# Altium project S11830_3344MT_2SiPM.PrjPCB
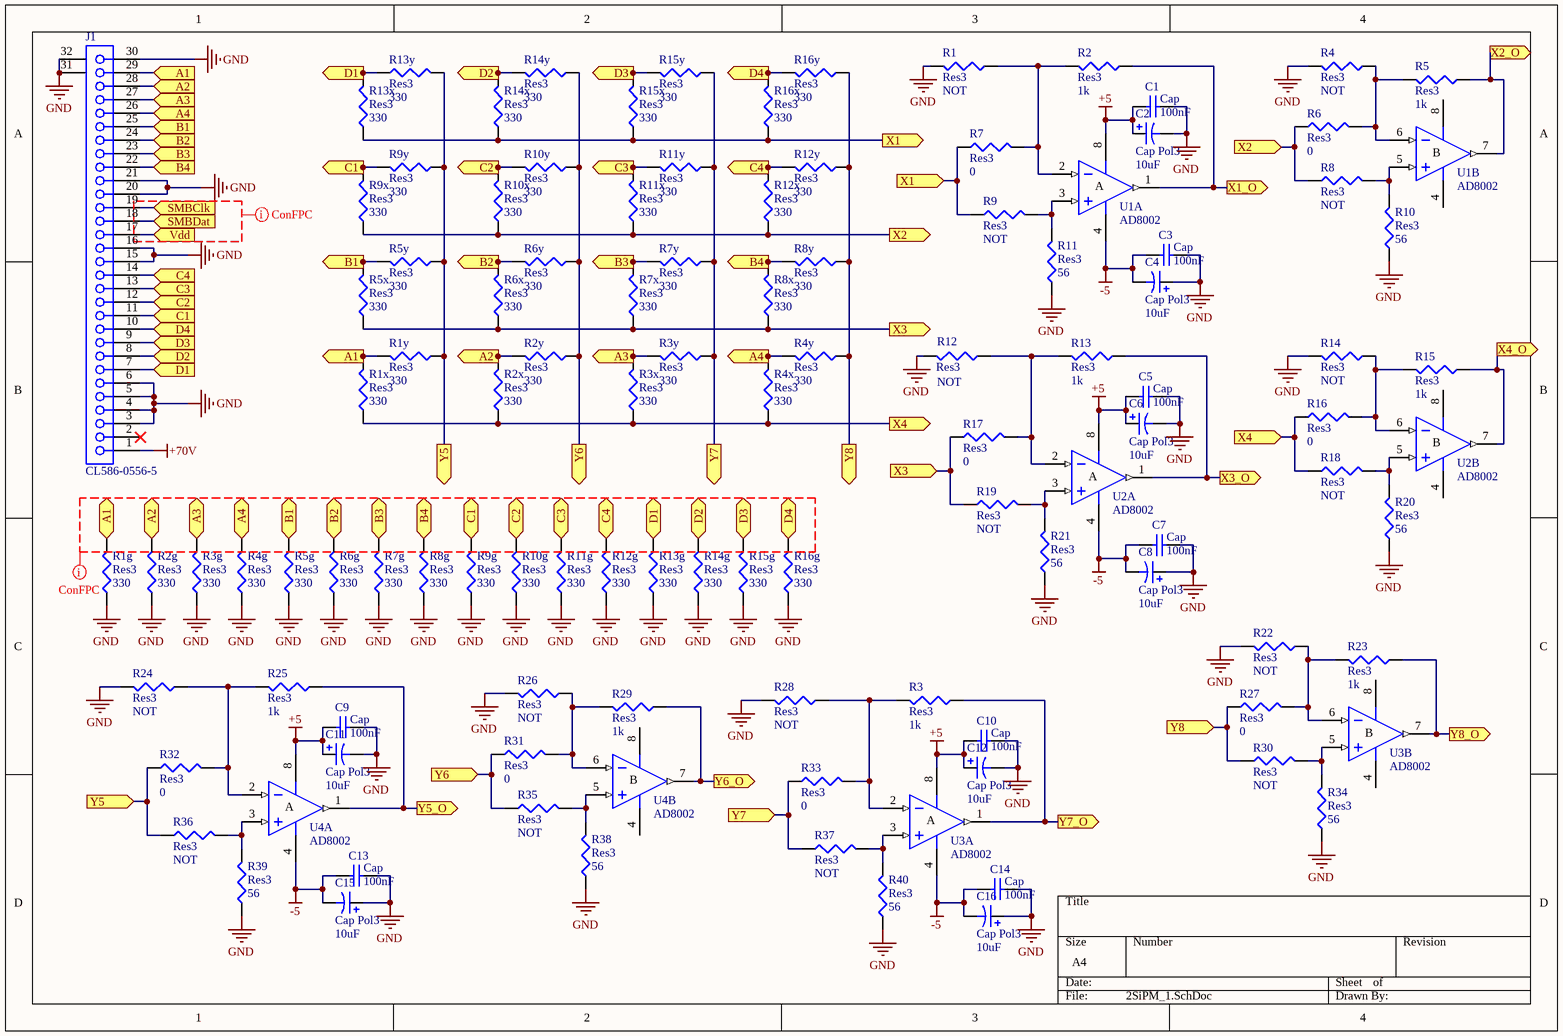
[diagram p0: 2SiPM_1.SchDoc]
4 sheets, 330 parts. Net scope: flat (ports and power ports of the same name join across sheets).
Board file: 2SiPM_PCB.PcbDoc
Sheets:
  2SiPM_1.SchDoc
  2SiPM_2.SchDoc
  2SiPM_3.SchDoc
  2SiPM_4.SchDoc

## Sheet 2SiPM_1.SchDoc
size A4

### Parts
C1  Cap  value 100nF  [6-0805_N]
C2  Cap Pol3  value 10uF  [6-0805_N]
C3  Cap  value 100nF  [6-0805_N]
C4  Cap Pol3  value 10uF  [6-0805_N]
C5  Cap  value 100nF  [6-0805_N]
C6  Cap Pol3  value 10uF  [6-0805_N]
C7  Cap  value 100nF  [6-0805_N]
C8  Cap Pol3  value 10uF  [6-0805_N]
C9  Cap  value 100nF  [6-0805_N]
C10  Cap  value 100nF  [6-0805_N]
C11  Cap Pol3  value 10uF  [6-0805_N]
C12  Cap Pol3  value 10uF  [6-0805_N]
C13  Cap  value 100nF  [6-0805_N]
C14  Cap  value 100nF  [6-0805_N]
C15  Cap Pol3  value 10uF  [6-0805_N]
C16  Cap Pol3  value 10uF  [6-0805_N]
J1  CL586-0556-5  [FH12A-30S-0.5SH]
R1  Res3  value NOT  [J1-0603]
R1g  Res3  value 330  [0402]
R1x  Res3  value 330  [0402]
R1y  Res3  value 330  [0402]
R2  Res3  value 1k  [J1-0603]
R2g  Res3  value 330  [0402]
R2x  Res3  value 330  [0402]
R2y  Res3  value 330  [0402]
R3  Res3  value 1k  [J1-0603]
R3g  Res3  value 330  [0402]
R3x  Res3  value 330  [0402]
R3y  Res3  value 330  [0402]
R4  Res3  value NOT  [J1-0603]
R4g  Res3  value 330  [0402]
R4x  Res3  value 330  [0402]
R4y  Res3  value 330  [0402]
R5  Res3  value 1k  [J1-0603]
R5g  Res3  value 330  [0402]
R5x  Res3  value 330  [0402]
R5y  Res3  value 330  [0402]
R6  Res3  value 0  [J1-0603]
R6g  Res3  value 330  [0402]
R6x  Res3  value 330  [0402]
R6y  Res3  value 330  [0402]
R7  Res3  value 0  [J1-0603]
R7g  Res3  value 330  [0402]
R7x  Res3  value 330  [0402]
R7y  Res3  value 330  [0402]
R8  Res3  value NOT  [J1-0603]
R8g  Res3  value 330  [0402]
R8x  Res3  value 330  [0402]
R8y  Res3  value 330  [0402]
R9  Res3  value NOT  [J1-0603]
R9g  Res3  value 330  [0402]
R9x  Res3  value 330  [0402]
R9y  Res3  value 330  [0402]
R10  Res3  value 56  [J1-0603]
R10g  Res3  value 330  [0402]
R10x  Res3  value 330  [0402]
R10y  Res3  value 330  [0402]
R11  Res3  value 56  [J1-0603]
R11g  Res3  value 330  [0402]
R11x  Res3  value 330  [0402]
R11y  Res3  value 330  [0402]
R12  Res3  value NOT  [J1-0603]
R12g  Res3  value 330  [0402]
R12x  Res3  value 330  [0402]
R12y  Res3  value 330  [0402]
R13  Res3  value 1k  [J1-0603]
R13g  Res3  value 330  [0402]
R13x  Res3  value 330  [0402]
R13y  Res3  value 330  [0402]
R14  Res3  value NOT  [J1-0603]
R14g  Res3  value 330  [0402]
R14x  Res3  value 330  [0402]
R14y  Res3  value 330  [0402]
R15  Res3  value 1k  [J1-0603]
R15g  Res3  value 330  [0402]
R15x  Res3  value 330  [0402]
R15y  Res3  value 330  [0402]
R16  Res3  value 0  [J1-0603]
R16g  Res3  value 330  [0402]
R16x  Res3  value 330  [0402]
R16y  Res3  value 330  [0402]
R17  Res3  value 0  [J1-0603]
R18  Res3  value NOT  [J1-0603]
R19  Res3  value NOT  [J1-0603]
R20  Res3  value 56  [J1-0603]
R21  Res3  value 56  [J1-0603]
R22  Res3  value NOT  [J1-0603]
R23  Res3  value 1k  [J1-0603]
R24  Res3  value NOT  [J1-0603]
R25  Res3  value 1k  [J1-0603]
R26  Res3  value NOT  [J1-0603]
R27  Res3  value 0  [J1-0603]
R28  Res3  value NOT  [J1-0603]
R29  Res3  value 1k  [J1-0603]
R30  Res3  value NOT  [J1-0603]
R31  Res3  value 0  [J1-0603]
R32  Res3  value 0  [J1-0603]
R33  Res3  value 0  [J1-0603]
R34  Res3  value 56  [J1-0603]
R35  Res3  value NOT  [J1-0603]
R36  Res3  value NOT  [J1-0603]
R37  Res3  value NOT  [J1-0603]
R38  Res3  value 56  [J1-0603]
R39  Res3  value 56  [J1-0603]
R40  Res3  value 56  [J1-0603]
U1  AD8002  [SO-8_M]  (parts A,B of 2)
U2  AD8002  [SO-8_M]  (parts A,B of 2)
U3  AD8002  [SO-8_M]  (parts A,B of 2)
U4  AD8002  [SO-8_M]  (parts A,B of 2)

### Ports
A1 (in), A1 (out), A2 (in), A2 (out), A3 (in), A3 (out), A4 (in), A4 (out), B1 (in), B1 (out), B2 (in), B2 (out), B3 (in), B3 (out), B4 (in), B4 (out), C1 (in), C1 (out), C2 (in), C2 (out), C3 (in), C3 (out), C4 (in), C4 (out), D1 (in), D1 (out), D2 (in), D2 (out), D3 (in), D3 (out), D4 (in), D4 (out), SMBClk (in), SMBDat (in), Vdd (in), X1 (in), X1 (out), X1_O (out), X2 (in), X2 (out), X2_O (out), X3 (in), X3 (out), X3_O (out), X4 (in), X4 (out), X4_O (out), Y5 (in), Y5 (out), Y5_O (out), Y6 (in), Y6 (out), Y6_O (out), Y7 (in), Y7 (out), Y7_O (out), Y8 (in), Y8 (out), Y8_O (out)

### Nets
+5: C1.2 C2.1 C5.2 C6.1 C9.2 C10.2 C11.1 C12.1 U1.8(V+) U2.8(V+) U3.8(V+) U4.8(V+)
+70V: J1.1
-5: C3.2 C4.2 C7.2 C8.2 C13.2 C14.2 C15.2 C16.2 U1.4(V-) U2.4(V-) U3.4(V-) U4.4(V-)
GND: C1.1 C2.2 C3.1 C4.1 C5.1 C6.2 C7.1 C8.1 C9.1 C10.1 C11.2 C12.2 C13.1 C14.1 C15.1 C16.1 J1.3 J1.4 J1.5 J1.6 J1.15 J1.16 J1.20 J1.21 J1.30 J1.31(MH1) J1.32(MH2) R1.2 R1g.1 R2g.1 R3g.1 R4.2 R4g.1 R5g.1 R6g.1 R7g.1 R8g.1 R9g.1 R10.1 R10g.1 R11.1 R11g.1 R12.2 R12g.1 R13g.1 R14.2 R14g.1 R15g.1 R16g.1 R20.1 R21.1 R22.2 R24.2 R26.2 R28.2 R34.1 R38.1 R39.1 R40.1
NetC1x_1: R2.1 U1.1(OUT) ; port X1_O
NetC2x_1: R5.1 U1.7(OUT) ; port X2_O
NetC3x_1: R13.1 U2.1(OUT) ; port X3_O
NetC4x_1: R15.1 U2.7(OUT) ; port X4_O
NetC5y_1: R25.1 U4.1(OUT) ; port Y5_O
NetC6y_1: R29.1 U4.7(OUT) ; port Y6_O
NetC7y_1: R3.1 U3.1(OUT) ; port Y7_O
NetC8y_1: R23.1 U3.7(OUT) ; port Y8_O
NetJ1_7: J1.7 R13g.2 R13x.2 R13y.1 ; port D1
NetJ1_8: J1.8 R14g.2 R14x.2 R14y.2 ; port D2
NetJ1_9: J1.9 R15g.2 R15x.2 R15y.2 ; port D3
NetJ1_10: J1.10 R16g.2 R16x.2 R16y.2 ; port D4
NetJ1_11: J1.11 R9g.2 R9x.2 R9y.2 ; port C1
NetJ1_12: J1.12 R10g.2 R10x.2 R10y.2 ; port C2
NetJ1_13: J1.13 R11g.2 R11x.2 R11y.2 ; port C3
NetJ1_14: J1.14 R12g.2 R12x.2 R12y.2 ; port C4
NetJ1_17: J1.17 ; port Vdd
NetJ1_18: J1.18 ; port SMBDat
NetJ1_19: J1.19 ; port SMBClk
NetJ1_22: J1.22 R8g.2 R8x.2 R8y.2 ; port B4
NetJ1_23: J1.23 R7g.2 R7x.2 R7y.2 ; port B3
NetJ1_24: J1.24 R6g.2 R6x.2 R6y.2 ; port B2
NetJ1_25: J1.25 R5g.2 R5x.2 R5y.2 ; port B1
NetJ1_26: J1.26 R4g.2 R4x.2 R4y.2 ; port A4
NetJ1_27: J1.27 R3g.2 R3x.2 R3y.2 ; port A3
NetJ1_28: J1.28 R2g.2 R2x.2 R2y.2 ; port A2
NetJ1_29: J1.29 R1g.2 R1x.2 R1y.2 ; port A1
NetR1_1: R1.1 R2.2 R7.2 U1.2(IN-)
NetR1x_1: R1x.1 R2x.1 R3x.1 R4x.1 R16.1 R18.1 ; port X4
NetR1x_1_1: R7.1 R9.1 R13x.1 R14x.1 R15x.1 R16x.1 ; port X1
NetR1y_1: R1y.1 R5y.1 R9y.1 R13y.2 R32.1 R36.1 ; port Y5
NetR2y_1: R2y.1 R6y.1 R10y.1 R14y.1 R31.1 R35.1 ; port Y6
NetR3_2: R3.2 R28.1 R33.2 U3.2(IN-)
NetR3y_1: R3y.1 R7y.1 R11y.1 R15y.1 R33.1 R37.1 ; port Y7
NetR4_1: R4.1 R5.2 R6.2 U1.6(IN-)
NetR4y_1: R4y.1 R8y.1 R12y.1 R16y.1 R27.1 R30.1 ; port Y8
NetR5x_1: R5x.1 R6x.1 R7x.1 R8x.1 R17.1 R19.1 ; port X3
NetR5x_1_1: R6.1 R8.1 R9x.1 R10x.1 R11x.1 R12x.1 ; port X2
NetR8_2: R8.2 R10.2 U1.5(IN+)
NetR9_2: R9.2 R11.2 U1.3(IN+)
NetR12_1: R12.1 R13.2 R17.2 U2.2(IN-)
NetR14_1: R14.1 R15.2 R16.2 U2.6(IN-)
NetR18_2: R18.2 R20.2 U2.5(IN+)
NetR19_2: R19.2 R21.2 U2.3(IN+)
NetR22_1: R22.1 R23.2 R27.2 U3.6(IN-)
NetR24_1: R24.1 R25.2 R32.2 U4.2(IN-)
NetR26_1: R26.1 R29.2 R31.2 U4.6(IN-)
NetR30_2: R30.2 R34.2 U3.5(IN+)
NetR35_2: R35.2 R38.2 U4.5(IN+)
NetR36_2: R36.2 R39.2 U4.3(IN+)
NetR37_2: R37.2 R40.2 U3.3(IN+)

Not connected (* = marked no-connect by the designer): J1 2*

### Layout directives
net class Undefined: (no net found under the mark)

### Notes on the sheet
- (in symbol AD8002AR, part A) A
- (in symbol AD8002AR, part B) B

### Library data of the parts
C1 C3 C5 C7 C9 C10 C13 C14 = Cap: Capacitor; Published: 8-Jun-2000; LatestRevisionDate: 17-Jul-2002; LatestRevisionNote: Re-released for DXP Platform.; PackageReference: RAD-0.3; Publisher: Altium Limited; PackageDescription: Radial Cap, Thru-Hole; 2 Leads; 0.3 in Pin Spacing
C2 C4 C6 C8 C11 C12 C15 C16 = Cap Pol3: Polarized Capacitor (Surface Mount); Published: 8-Jun-2000; LatestRevisionDate: 29-May-2009; LatestRevisionNote: IPC-7351 Footprint Added.; PackageReference: C0805; Publisher: Altium Limited; PackageDescription: Chip Capacitor
J1 = CL586-0556-5: FH12 Series, "Flip-Lock" SMT/ZIF FFC/FPC Connector - 0.5mm Spaced Top Contact; Positions: 30; ContactMaterial: Phosphor Bronze; Current: 0.4A; PCB_Layout: Complies with manufacturer's recommendation.; Note: Pad dimensions follow nominal values, Suitable for Wave Soldering, Adjust for Re-flow.; Published: 17-Jul-2002; DatasheetVersion: 13-Nov-2000; PackageVersion: 13-Nov-2000; PackageReference: FH12A-30S-0.5SH; Publisher: Altium Limited; ComponentLink1Description: Manufacturer Link; ComponentLink1URL: http://www.hiroseusa.com/; ComponentLink2Description: Datasheet; ComponentLink2URL: http://www.hirose.co.jp/cataloge_hp/e58605370.pdf
R1 R1g R1x R1y R2 R2g R2x R2y R3 R3g R3x R3y R4 R4g R4x R4y R5 R5g R5x R5y R6 R6g R6x R6y R7 R7g R7x R7y R8 R8g R8x R8y R9 R9g R9x R9y R10 R10g R10x R10y R11 R11g R11x R11y R12 R12g R12x R12y R13 R13g R13x R13y R14 R14g R14x R14y R15 R15g R15x R15y R16 R16g R16x R16y R17-R40 = Res3: Resistor; Published: 8-Jun-2000; LatestRevisionDate: 29-May-2009; LatestRevisionNote: IPC-7351 Footprint Added.; PackageReference: J1-0603; Publisher: Altium Limited; PackageDescription: Chip Resistor
U1-U4 = AD8002AR: Dual 600MHz, 50mW Current Feedback Amplifier; Published: 8-Jun-2000; LatestRevisionDate: 13-Apr-2006; LatestRevisionNote: IPC-7351 Footprint Added.; DatasheetVersion: REV. C 1999; PackageVersion: revA; PackageReference: SO-8; Publisher: Altium Limited; PackageDescription: 8-Pin Small Outline Integrated Circuit 1.27 mm Pitch; Code_JEDEC: MS-012-AA; Code_IPC: SOIC127P600-8; ComponentLink1Description: Manufacturer Link; ComponentLink1URL: http://www.analog.com/en/prod/0,,759_786_AD8002%2C00.html; ComponentLink2Description: Datasheet; ComponentLink2URL: http://www.analog.com/UploadedFiles/Data_Sheets/147523773AD8002_d.pdf

## Sheet 2SiPM_2.SchDoc
size A4
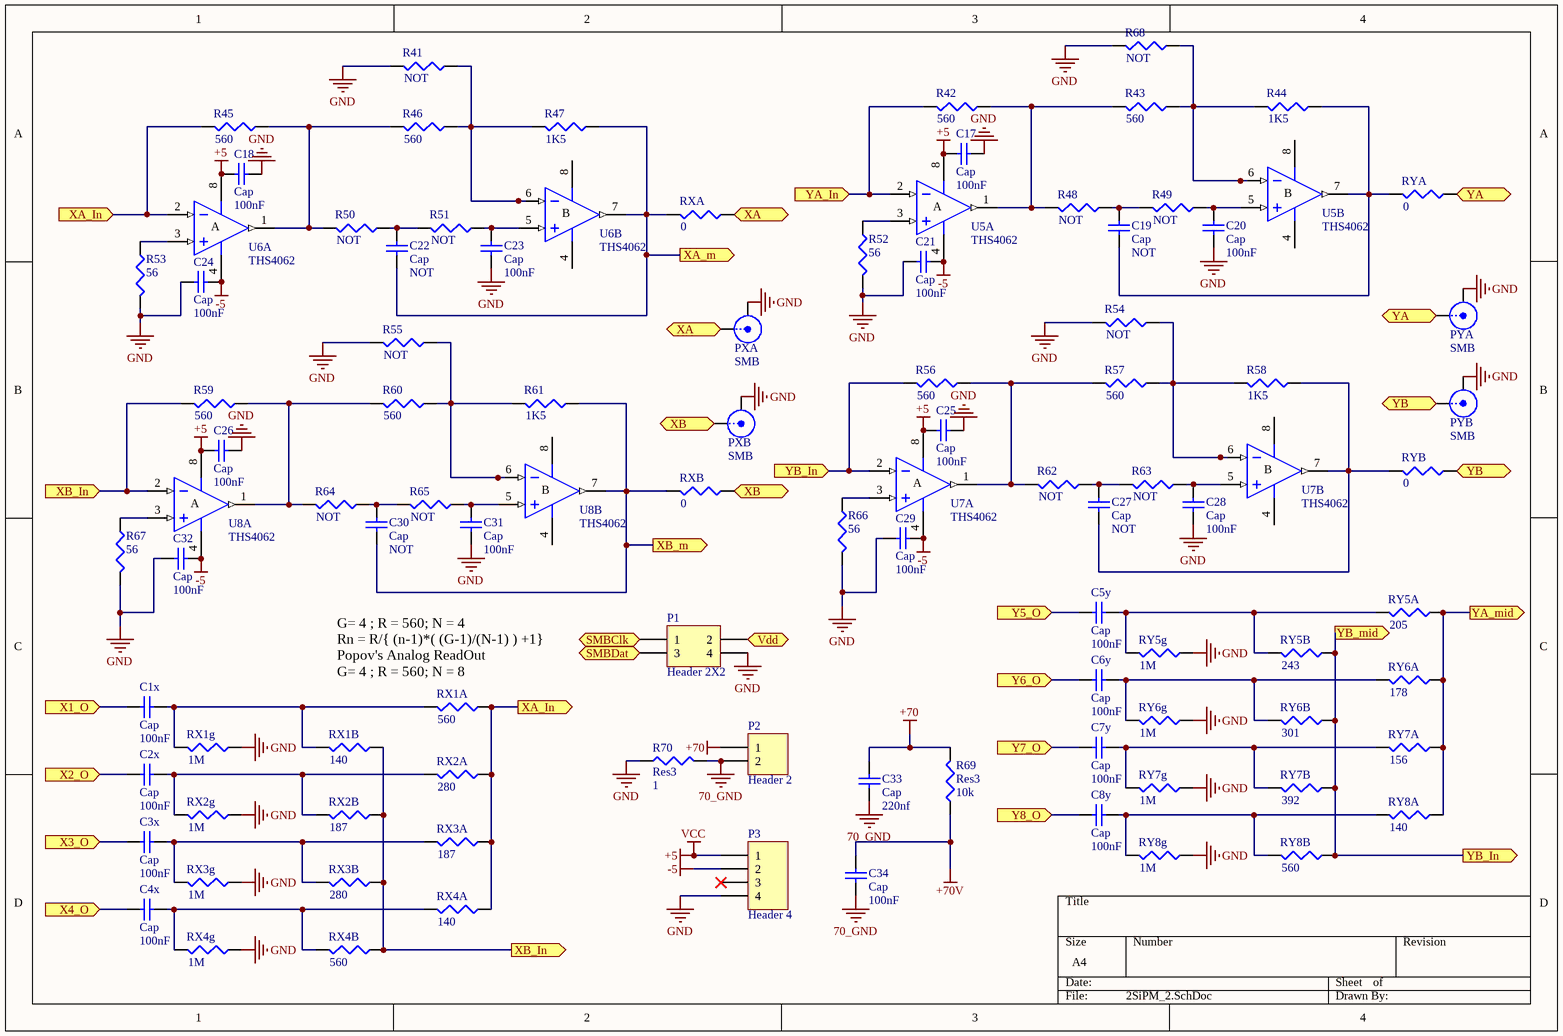
[diagram p1: 2SiPM_2.SchDoc]

### Parts
C1x  Cap  value 100nF  [1608[0603]]
C2x  Cap  value 100nF  [1608[0603]]
C3x  Cap  value 100nF  [1608[0603]]
C4x  Cap  value 100nF  [1608[0603]]
C5y  Cap  value 100nF  [1608[0603]]
C6y  Cap  value 100nF  [1608[0603]]
C7y  Cap  value 100nF  [1608[0603]]
C8y  Cap  value 100nF  [1608[0603]]
C17  Cap  value 100nF  [1608[0603]]
C18  Cap  value 100nF  [1608[0603]]
C19  Cap  value NOT  [1608[0603]]
C20  Cap  value 100nF  [1608[0603]]
C21  Cap  value 100nF  [1608[0603]]
C22  Cap  value NOT  [1608[0603]]
C23  Cap  value 100nF  [1608[0603]]
C24  Cap  value 100nF  [1608[0603]]
C25  Cap  value 100nF  [1608[0603]]
C26  Cap  value 100nF  [1608[0603]]
C27  Cap  value NOT  [1608[0603]]
C28  Cap  value 100nF  [1608[0603]]
C29  Cap  value 100nF  [1608[0603]]
C30  Cap  value NOT  [1608[0603]]
C31  Cap  value 100nF  [1608[0603]]
C32  Cap  value 100nF  [1608[0603]]
C33  Cap  value 220nf  [6-0805_N]
C34  Cap  value 100nF  [6-0805_N]
P1  Header 2X2  [HDR2X2]
P2  Header 2  [HDR1X2]
P3  Header 4  [HDR1X4]
PXA  SMB  [SMB_V-RJ45]
PXB  SMB  [SMB_V-RJ45]
PYA  SMB  [SMB_V-RJ45]
PYB  SMB  [SMB_V-RJ45]
R41  value NOT  [J1-0603]  (hidden comment: Res3)
R42  value 560  [J1-0603]  (hidden comment: Res3)
R43  value 560  [J1-0603]  (hidden comment: Res3)
R44  value 1K5  [J1-0603]  (hidden comment: Res3)
R45  value 560  [J1-0603]  (hidden comment: Res3)
R46  value 560  [J1-0603]  (hidden comment: Res3)
R47  value 1K5  [J1-0603]  (hidden comment: Res3)
R48  value NOT  [J1-0603]  (hidden comment: Res3)
R49  value NOT  [J1-0603]  (hidden comment: Res3)
R50  value NOT  [J1-0603]  (hidden comment: Res3)
R51  value NOT  [J1-0603]  (hidden comment: Res3)
R52  value 56  [J1-0603]  (hidden comment: Res3)
R53  value 56  [J1-0603]  (hidden comment: Res3)
R54  value NOT  [J1-0603]  (hidden comment: Res3)
R55  value NOT  [J1-0603]  (hidden comment: Res3)
R56  value 560  [J1-0603]  (hidden comment: Res3)
R57  value 560  [J1-0603]  (hidden comment: Res3)
R58  value 1K5  [J1-0603]  (hidden comment: Res3)
R59  value 560  [J1-0603]  (hidden comment: Res3)
R60  value 560  [J1-0603]  (hidden comment: Res3)
R61  value 1K5  [J1-0603]  (hidden comment: Res3)
R62  value NOT  [J1-0603]  (hidden comment: Res3)
R63  value NOT  [J1-0603]  (hidden comment: Res3)
R64  value NOT  [J1-0603]  (hidden comment: Res3)
R65  value NOT  [J1-0603]  (hidden comment: Res3)
R66  value 56  [J1-0603]  (hidden comment: Res3)
R67  value 56  [J1-0603]  (hidden comment: Res3)
R68  value NOT  [J1-0603]  (hidden comment: Res3)
R69  Res3  value 10k  [6-0805_N]
R70  Res3  value 1  [6-0805_N]
RX1A  value 560  [J1-0603]  (hidden comment: Res3)
RX1B  value 140  [J1-0603]  (hidden comment: Res3)
RX1g  value 1M  [J1-0603]  (hidden comment: Res3)
RX2A  value 280  [J1-0603]  (hidden comment: Res3)
RX2B  value 187  [J1-0603]  (hidden comment: Res3)
RX2g  value 1M  [J1-0603]  (hidden comment: Res3)
RX3A  value 187  [J1-0603]  (hidden comment: Res3)
RX3B  value 280  [J1-0603]  (hidden comment: Res3)
RX3g  value 1M  [J1-0603]  (hidden comment: Res3)
RX4A  value 140  [J1-0603]  (hidden comment: Res3)
RX4B  value 560  [J1-0603]  (hidden comment: Res3)
RX4g  value 1M  [J1-0603]  (hidden comment: Res3)
RXA  value 0  [J1-0603]  (hidden comment: Res3)
RXB  value 0  [J1-0603]  (hidden comment: Res3)
RY5A  value 205  [J1-0603]  (hidden comment: Res3)
RY5B  value 243  [J1-0603]  (hidden comment: Res3)
RY5g  value 1M  [J1-0603]  (hidden comment: Res3)
RY6A  value 178  [J1-0603]  (hidden comment: Res3)
RY6B  value 301  [J1-0603]  (hidden comment: Res3)
RY6g  value 1M  [J1-0603]  (hidden comment: Res3)
RY7A  value 156  [J1-0603]  (hidden comment: Res3)
RY7B  value 392  [J1-0603]  (hidden comment: Res3)
RY7g  value 1M  [J1-0603]  (hidden comment: Res3)
RY8A  value 140  [J1-0603]  (hidden comment: Res3)
RY8B  value 560  [J1-0603]  (hidden comment: Res3)
RY8g  value 1M  [J1-0603]  (hidden comment: Res3)
RYA  value 0  [J1-0603]  (hidden comment: Res3)
RYB  value 0  [J1-0603]  (hidden comment: Res3)
U5  THS4062  [SO8_M]  (parts A,B of 2)
U6  THS4062  [SO8_M]  (parts A,B of 2)
U7  THS4062  [SO8_M]  (parts A,B of 2)
U8  THS4062  [SO8_M]  (parts A,B of 2)

### Ports
SMBClk (out), SMBDat (out), Vdd (out), X1_O (in), X2_O (in), X3_O (in), X4_O (in), XA (out), XA_In (in), XA_In (out), XA_m (out), XB (out), XB_In (in), XB_In (out), XB_m (out), Y5_O (in), Y6_O (in), Y7_O (in), Y8_O (in), YA (out), YA_In (in), YA_mid (out), YB (out), YB_In (in), YB_In (out), YB_mid (out)

### Nets
70_GND: C33.1 C34.1 P2.2 R70.2
+5: C17.1 C18.1 C25.1 C26.1 P3.1 U5.8(V+) U6.8(V+) U7.8(V+) U8.8(V+)  [also labelled VCC]
+70: C33.2 P2.1 R69.2
+70V: C34.2 R69.1
-5: C21.2 C24.2 C29.2 C32.2 P3.2 U5.4(V-) U6.4(V-) U7.4(V-) U8.4(V-)
GND: C17.2 C18.2 C20.2 C21.1 C23.2 C24.1 C25.2 C26.2 C28.2 C29.1 C31.2 C32.1 P1.4 P3.4 PXA.2(Y) PXB.2(Y) PYA.2(Y) PYB.2(Y) R41.2 R52.2 R53.2 R54.2 R55.2 R66.2 R67.2 R68.2 R70.1 RX1g.1 RX2g.1 RX3g.1 RX4g.1 RY5g.1 RY6g.1 RY7g.1 RY8g.1
NetC1x_1: C1x.1 ; port X1_O
NetC1x_2: C1x.2 RX1A.2 RX1B.2 RX1g.2
NetC2x_1: C2x.1 ; port X2_O
NetC2x_2: C2x.2 RX2A.2 RX2B.2 RX2g.2
NetC3x_1: C3x.1 ; port X3_O
NetC3x_2: C3x.2 RX3A.2 RX3B.2 RX3g.2
NetC4x_1: C4x.1 ; port X4_O
NetC4x_2: C4x.2 RX4A.2 RX4B.2 RX4g.2
NetC5y_1: C5y.1 ; port Y5_O
NetC5y_2: C5y.2 RY5A.2 RY5B.2 RY5g.2
NetC6y_1: C6y.1 ; port Y6_O
NetC6y_2: C6y.2 RY6A.2 RY6B.2 RY6g.2
NetC7y_1: C7y.1 ; port Y7_O
NetC7y_2: C7y.2 RY7A.2 RY7B.2 RY7g.2
NetC8y_1: C8y.1 ; port Y8_O
NetC8y_2: C8y.2 RY8A.2 RY8B.2 RY8g.2
NetC19_1: C19.1 R48.1 R49.2
NetC19_2: C19.2 R44.1 RYA.2 U5.7(OUT)
NetC20_1: C20.1 R49.1 U5.5(IN+)
NetC22_1: C22.1 R50.1 R51.2
NetC22_2: C22.2 R47.1 RXA.2 U6.7(OUT) ; port XA_m
NetC23_1: C23.1 R51.1 U6.5(IN+)
NetC27_1: C27.1 R62.1 R63.2
NetC27_2: C27.2 R58.1 RYB.2 U7.7(OUT)
NetC28_1: C28.1 R63.1 U7.5(IN+)
NetC30_1: C30.1 R64.1 R65.2
NetC30_2: C30.2 R61.1 RXB.2 U8.7(OUT) ; port XB_m
NetC31_1: C31.1 R65.1 U8.5(IN+)
NetJ1_17: P1.2 ; port Vdd
NetJ1_18: P1.3 ; port SMBDat
NetJ1_19: P1.1 ; port SMBClk
NetPXA_1: PXA.1(X) RXA.1 ; port XA
NetPXB_1: PXB.1(X) RXB.1 ; port XB
NetPYA_1: PYA.1(X) RYA.1 ; port YA
NetPYB_1: PYB.1(X) RYB.1 ; port YB
NetR41_1: R41.1 R46.1 R47.2 U6.6(IN-)
NetR42_1: R42.1 R43.2 R48.2 U5.1(OUT)
NetR42_2: R42.2 RY5A.1 RY6A.1 RY7A.1 RY8A.1 U5.2(IN-) ; port YA_In, port YA_mid
NetR43_1: R43.1 R44.2 R68.1 U5.6(IN-)
NetR45_1: R45.1 R46.2 R50.2 U6.1(OUT)
NetR45_2: R45.2 RX1A.1 RX2A.1 RX3A.1 RX4A.1 U6.2(IN-) ; port XA_In
NetR52_1: R52.1 U5.3(IN+)
NetR53_1: R53.1 U6.3(IN+)
NetR54_1: R54.1 R57.1 R58.2 U7.6(IN-)
NetR55_1: R55.1 R60.1 R61.2 U8.6(IN-)
NetR56_1: R56.1 R57.2 R62.2 U7.1(OUT)
NetR56_2: R56.2 RY5B.1 RY6B.1 RY7B.1 RY8B.1 U7.2(IN-) ; port YB_In, port YB_mid
NetR59_1: R59.1 R60.2 R64.2 U8.1(OUT)
NetR59_2: R59.2 RX1B.1 RX2B.1 RX3B.1 RX4B.1 U8.2(IN-) ; port XB_In
NetR66_1: R66.1 U7.3(IN+)
NetR67_1: R67.1 U8.3(IN+)

Not connected (* = marked no-connect by the designer): P3 3*

### Notes on the sheet
- (near RX1A) G= 4 ; R = 560; N = 4
  Rn = R/{ (n-1)*( (G-1)/(N-1) ) +1}
  Popov's Analog ReadOut
  G= 4 ; R = 560; N = 8
- (in symbol AD8056ARM, part A) A
- (in symbol AD8056ARM, part B) B

### Library data of the parts
C1x C2x C3x C4x C5y C6y C7y C8y C17-C34 = Cap: Capacitor; Published: 8-Jun-2000; LatestRevisionDate: 17-Jul-2002; LatestRevisionNote: Re-released for DXP Platform.; PackageReference: RAD-0.3; Publisher: Altium Limited; PackageDescription: Radial Cap, Thru-Hole; 2 Leads; 0.3 in Pin Spacing
P1 = Header 2X2: Header, 2-Pin, Dual row; LatestRevisionDate: 17-Jul-2002; LatestRevisionNote: Re-released for DXP Platform.; Publisher: Altium Limited
P2 = Header 2: Header, 2-Pin; LatestRevisionDate: 17-Jul-2002; LatestRevisionNote: Re-released for DXP Platform.; Publisher: Altium Limited
P3 = Header 4: Header, 4-Pin; LatestRevisionDate: 17-Jul-2002; LatestRevisionNote: Re-released for DXP Platform.; Publisher: Altium Limited
PXA PXB PYA PYB = SMB: SMB Straight Connector; LatestRevisionDate: 17-Jul-2002; LatestRevisionNote: Re-released for DXP Platform.; Publisher: Altium Limited
R41-R70 RX1A RX1B RX1g RX2A RX2B RX2g RX3A RX3B RX3g RX4A RX4B RX4g RXA RXB RY5A RY5B RY5g RY6A RY6B RY6g RY7A RY7B RY7g RY8A RY8B RY8g RYA RYB = Res3: Resistor; Published: 8-Jun-2000; LatestRevisionDate: 29-May-2009; LatestRevisionNote: IPC-7351 Footprint Added.; PackageReference: J1-0603; Publisher: Altium Limited; PackageDescription: Chip Resistor
U5-U8 = AD8056ARM: Low Cost, 300MHz Voltage Feedback Amplifier; Published: 8-Jun-2000; LatestRevisionDate: 04-Mar-2005; LatestRevisionNote: Stylized 3D Model Added, PCB footprint pad width decreased.; DatasheetVersion: REV. 0 1997; PackageVersion: 2004; PackageReference: RM-8; Publisher: Altium Limited; PackageDescription: Shrink Small Outline, MSOP; 8 Leads; Body Width 3 mm; Pitch 0.65 mm; Code_JEDEC: MO-187-AA; ComponentLink1Description: Manufacturer Link; ComponentLink1URL: http://www.analog.com/en/prod/0,,759_786_AD8055%2C00.html; ComponentLink2Description: Datasheet; ComponentLink2URL: http://www.analog.com/UploadedFiles/Data_Sheets/40402558757264AD8055_6_i.pdf

## Sheet 2SiPM_3.SchDoc
size A4
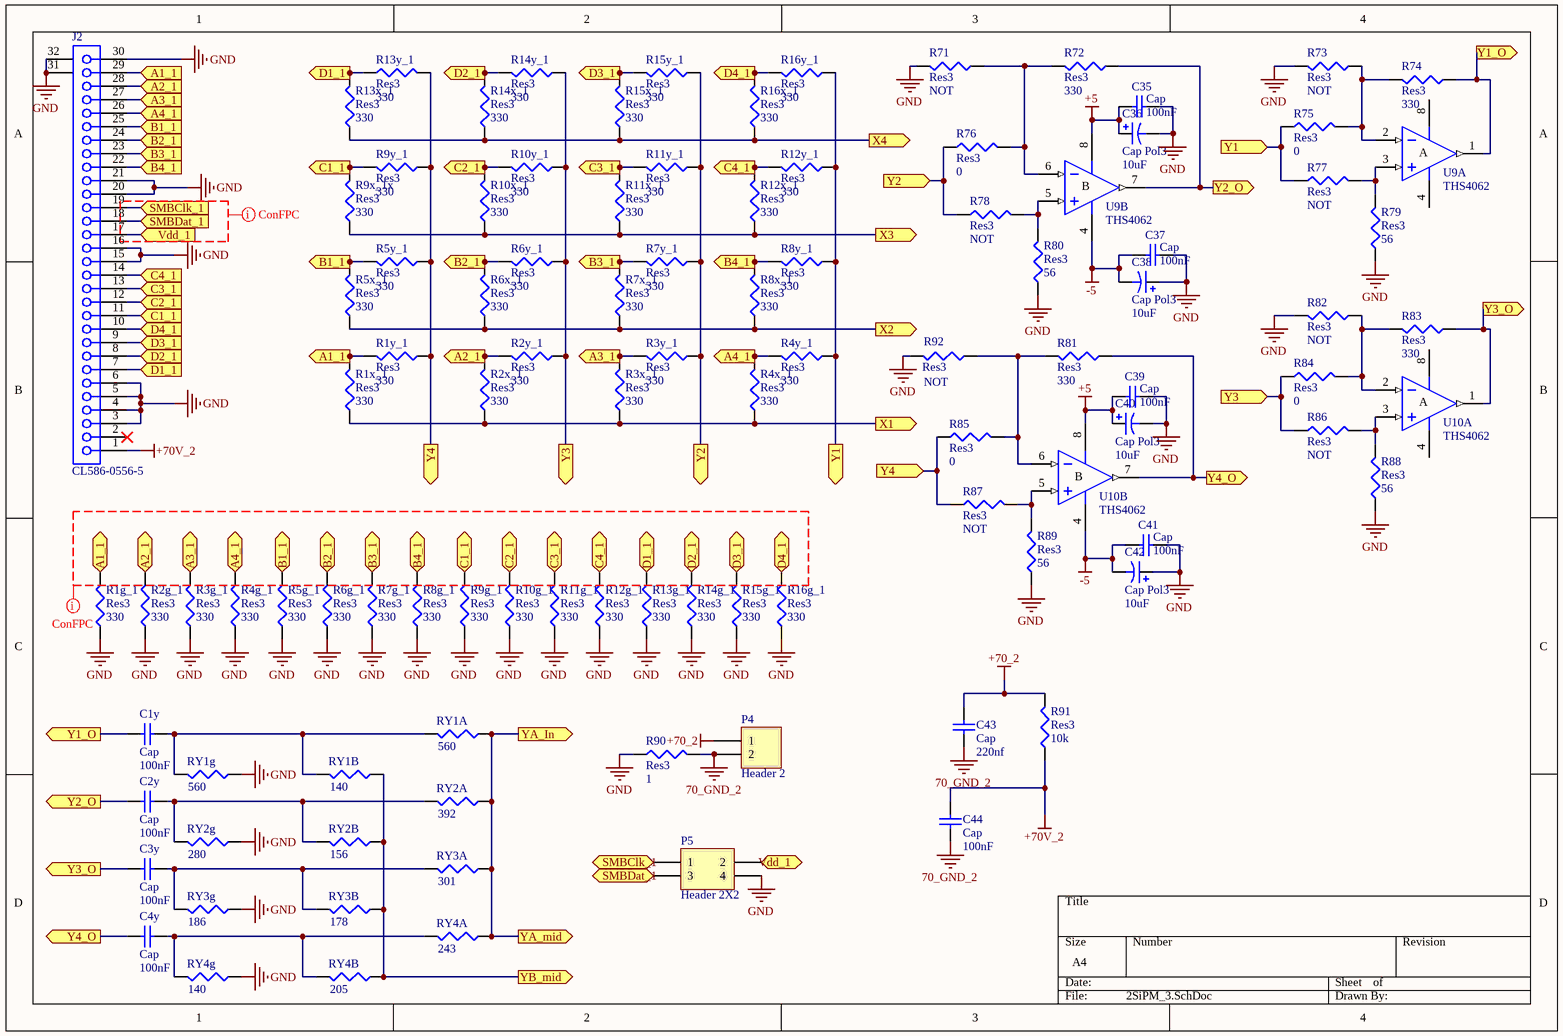
[diagram p2: 2SiPM_3.SchDoc]

### Parts
C1y  Cap  value 100nF  [1608[0603]]
C2y  Cap  value 100nF  [1608[0603]]
C3y  Cap  value 100nF  [1608[0603]]
C4y  Cap  value 100nF  [1608[0603]]
C35  Cap  value 100nF  [6-0805_N]
C36  Cap Pol3  value 10uF  [6-0805_N]
C37  Cap  value 100nF  [6-0805_N]
C38  Cap Pol3  value 10uF  [6-0805_N]
C39  Cap  value 100nF  [6-0805_N]
C40  Cap Pol3  value 10uF  [6-0805_N]
C41  Cap  value 100nF  [6-0805_N]
C42  Cap Pol3  value 10uF  [6-0805_N]
C43  Cap  value 220nf  [6-0805_N]
C44  Cap  value 100nF  [6-0805_N]
J2  CL586-0556-5  [FH12A-30S-0.5SH]
P4  Header 2  [HDR1X2]
P5  Header 2X2  [HDR2X2]
R1g_1  Res3  value 330  [0402]
R1x_1  Res3  value 330  [0402]
R1y_1  Res3  value 330  [0402]
R2g_1  Res3  value 330  [0402]
R2x_1  Res3  value 330  [0402]
R2y_1  Res3  value 330  [0402]
R3g_1  Res3  value 330  [0402]
R3x_1  Res3  value 330  [0402]
R3y_1  Res3  value 330  [0402]
R4g_1  Res3  value 330  [0402]
R4x_1  Res3  value 330  [0402]
R4y_1  Res3  value 330  [0402]
R5g_1  Res3  value 330  [0402]
R5x_1  Res3  value 330  [0402]
R5y_1  Res3  value 330  [0402]
R6g_1  Res3  value 330  [0402]
R6x_1  Res3  value 330  [0402]
R6y_1  Res3  value 330  [0402]
R7g_1  Res3  value 330  [0402]
R7x_1  Res3  value 330  [0402]
R7y_1  Res3  value 330  [0402]
R8g_1  Res3  value 330  [0402]
R8x_1  Res3  value 330  [0402]
R8y_1  Res3  value 330  [0402]
R9g_1  Res3  value 330  [0402]
R9x_1x  Res3  value 330  [0402]
R9y_1  Res3  value 330  [0402]
R10g_1  Res3  value 330  [0402]
R10x_1  Res3  value 330  [0402]
R10y_1  Res3  value 330  [0402]
R11g_1  Res3  value 330  [0402]
R11x_1  Res3  value 330  [0402]
R11y_1  Res3  value 330  [0402]
R12g_1  Res3  value 330  [0402]
R12x_1  Res3  value 330  [0402]
R12y_1  Res3  value 330  [0402]
R13g_1  Res3  value 330  [0402]
R13x_1  Res3  value 330  [0402]
R13y_1  Res3  value 330  [0402]
R14g_1  Res3  value 330  [0402]
R14x_1  Res3  value 330  [0402]
R14y_1  Res3  value 330  [0402]
R15g_1  Res3  value 330  [0402]
R15x_1  Res3  value 330  [0402]
R15y_1  Res3  value 330  [0402]
R16g_1  Res3  value 330  [0402]
R16x_1  Res3  value 330  [0402]
R16y_1  Res3  value 330  [0402]
R71  Res3  value NOT  [J1-0603]
R72  Res3  value 330  [J1-0603]
R73  Res3  value NOT  [J1-0603]
R74  Res3  value 330  [J1-0603]
R75  Res3  value 0  [J1-0603]
R76  Res3  value 0  [J1-0603]
R77  Res3  value NOT  [J1-0603]
R78  Res3  value NOT  [J1-0603]
R79  Res3  value 56  [J1-0603]
R80  Res3  value 56  [J1-0603]
R81  Res3  value 330  [J1-0603]
R82  Res3  value NOT  [J1-0603]
R83  Res3  value 330  [J1-0603]
R84  Res3  value 0  [J1-0603]
R85  Res3  value 0  [J1-0603]
R86  Res3  value NOT  [J1-0603]
R87  Res3  value NOT  [J1-0603]
R88  Res3  value 56  [J1-0603]
R89  Res3  value 56  [J1-0603]
R90  Res3  value 1  [6-0805_N]
R91  Res3  value 10k  [6-0805_N]
R92  Res3  value NOT  [J1-0603]
RY1A  value 560  [J1-0603]  (hidden comment: Res3)
RY1B  value 140  [J1-0603]  (hidden comment: Res3)
RY1g  value 560  [J1-0603]  (hidden comment: Res3)
RY2A  value 392  [J1-0603]  (hidden comment: Res3)
RY2B  value 156  [J1-0603]  (hidden comment: Res3)
RY2g  value 280  [J1-0603]  (hidden comment: Res3)
RY3A  value 301  [J1-0603]  (hidden comment: Res3)
RY3B  value 178  [J1-0603]  (hidden comment: Res3)
RY3g  value 186  [J1-0603]  (hidden comment: Res3)
RY4A  value 243  [J1-0603]  (hidden comment: Res3)
RY4B  value 205  [J1-0603]  (hidden comment: Res3)
RY4g  value 140  [J1-0603]  (hidden comment: Res3)
U9  THS4062  [SO-8_M]  (parts A,B of 2)
U10  THS4062  [SO-8_M]  (parts A,B of 2)

### Ports
A1_1 (in), A1_1 (out), A2_1 (in), A2_1 (out), A3_1 (in), A3_1 (out), A4_1 (in), A4_1 (out), B1_1 (in), B1_1 (out), B2_1 (in), B2_1 (out), B3_1 (in), B3_1 (out), B4_1 (in), B4_1 (out), C1_1 (in), C1_1 (out), C2_1 (in), C2_1 (out), C3_1 (in), C3_1 (out), C4_1 (in), C4_1 (out), D1_1 (in), D1_1 (out), D2_1 (in), D2_1 (out), D3_1 (in), D3_1 (out), D4_1 (in), D4_1 (out), SMBClk_1 (in), SMBClk_1 (out), SMBDat_1 (in), SMBDat_1 (out), Vdd_1 (in), Vdd_1 (out), X1 (out), X2 (out), X3 (out), X4 (out), Y1 (in), Y1 (out), Y1_O (out), Y2 (in), Y2 (out), Y2_O (out), Y3 (in), Y3 (out), Y3_O (out), Y4 (in), Y4 (out), Y4_O (out), YA_In (out), YA_mid (out), YB_mid (out)

### Nets
70_GND_2: C43.1 C44.1 P4.2 R90.2
+5: C35.2 C36.1 C39.2 C40.1 U9.8(V+) U10.8(V+)
+70_2: C43.2 P4.1 R91.2
+70V_2: C44.2 J2.1 R91.1
-5: C37.2 C38.2 C41.2 C42.2 U9.4(V-) U10.4(V-)
GND: C35.1 C36.2 C37.1 C38.1 C39.1 C40.2 C41.1 C42.1 J2.3 J2.4 J2.5 J2.6 J2.15 J2.16 J2.20 J2.21 J2.30 J2.31(MH1) J2.32(MH2) P5.4 R1g_1.1 R2g_1.1 R3g_1.1 R4g_1.1 R5g_1.1 R6g_1.1 R7g_1.1 R8g_1.1 R9g_1.1 R10g_1.1 R11g_1.1 R12g_1.1 R13g_1.1 R14g_1.1 R15g_1.1 R16g_1.1 R71.2 R73.2 R79.1 R80.1 R82.2 R88.1 R89.1 R90.1 R92.2 RY1g.1 RY2g.1 RY3g.1 RY4g.1
NetC1y_1: C1y.1 R74.1 U9.1(OUT) ; port Y1_O
NetC1y_2: C1y.2 RY1A.2 RY1B.2 RY1g.2
NetC2y_1: C2y.1 R72.1 U9.7(OUT) ; port Y2_O
NetC2y_2: C2y.2 RY2A.2 RY2B.2 RY2g.2
NetC3y_1: C3y.1 R83.1 U10.1(OUT) ; port Y3_O
NetC3y_2: C3y.2 RY3A.2 RY3B.2 RY3g.2
NetC4y_1: C4y.1 R81.1 U10.7(OUT) ; port Y4_O
NetC4y_2: C4y.2 RY4A.2 RY4B.2 RY4g.2
NetJ2_7: J2.7 R13g_1.2 R13x_1.2 R13y_1.1 ; port D1_1
NetJ2_8: J2.8 R14g_1.2 R14x_1.2 R14y_1.2 ; port D2_1
NetJ2_9: J2.9 R15g_1.2 R15x_1.2 R15y_1.2 ; port D3_1
NetJ2_10: J2.10 R16g_1.2 R16x_1.2 R16y_1.2 ; port D4_1
NetJ2_11: J2.11 R9g_1.2 R9x_1x.2 R9y_1.2 ; port C1_1
NetJ2_12: J2.12 R10g_1.2 R10x_1.2 R10y_1.2 ; port C2_1
NetJ2_13: J2.13 R11g_1.2 R11x_1.2 R11y_1.2 ; port C3_1
NetJ2_14: J2.14 R12g_1.2 R12x_1.2 R12y_1.2 ; port C4_1
NetJ2_17: J2.17 P5.2 ; port Vdd_1
NetJ2_18: J2.18 P5.3 ; port SMBDat_1
NetJ2_19: J2.19 P5.1 ; port SMBClk_1
NetJ2_22: J2.22 R8g_1.2 R8x_1.2 R8y_1.2 ; port B4_1
NetJ2_23: J2.23 R7g_1.2 R7x_1.2 R7y_1.2 ; port B3_1
NetJ2_24: J2.24 R6g_1.2 R6x_1.2 R6y_1.2 ; port B2_1
NetJ2_25: J2.25 R5g_1.2 R5x_1.2 R5y_1.2 ; port B1_1
NetJ2_26: J2.26 R4g_1.2 R4x_1.2 R4y_1.2 ; port A4_1
NetJ2_27: J2.27 R3g_1.2 R3x_1.2 R3y_1.2 ; port A3_1
NetJ2_28: J2.28 R2g_1.2 R2x_1.2 R2y_1.2 ; port A2_1
NetJ2_29: J2.29 R1g_1.2 R1x_1.2 R1y_1.2 ; port A1_1
NetR1x_1: R13x_1.1 R14x_1.1 R15x_1.1 R16x_1.1 ; port X4
NetR1x_1_1: R1x_1.1 R2x_1.1 R3x_1.1 R4x_1.1 ; port X1
NetR1y_1_1: R1y_1.1 R5y_1.1 R9y_1.1 R13y_1.2 R85.1 R87.1 ; port Y4
NetR2y_1_1: R2y_1.1 R6y_1.1 R10y_1.1 R14y_1.1 R84.1 R86.1 ; port Y3
NetR3y_1_1: R3y_1.1 R7y_1.1 R11y_1.1 R15y_1.1 R76.1 R78.1 ; port Y2
NetR4y_1_1: R4y_1.1 R8y_1.1 R12y_1.1 R16y_1.1 R75.1 R77.1 ; port Y1
NetR5x_1: R9x_1x.1 R10x_1.1 R11x_1.1 R12x_1.1 ; port X3
NetR5x_1_1: R5x_1.1 R6x_1.1 R7x_1.1 R8x_1.1 ; port X2
NetR42_2: RY1A.1 RY2A.1 RY3A.1 RY4A.1 ; port YA_In, port YA_mid
NetR56_2: RY1B.1 RY2B.1 RY3B.1 RY4B.1 ; port YB_mid
NetR71_1: R71.1 R72.2 R76.2 U9.6(IN-)
NetR73_1: R73.1 R74.2 R75.2 U9.2(IN-)
NetR77_2: R77.2 R79.2 U9.3(IN+)
NetR78_2: R78.2 R80.2 U9.5(IN+)
NetR81_2: R81.2 R85.2 R92.1 U10.6(IN-)
NetR82_1: R82.1 R83.2 R84.2 U10.2(IN-)
NetR86_2: R86.2 R88.2 U10.3(IN+)
NetR87_2: R87.2 R89.2 U10.5(IN+)

Not connected (* = marked no-connect by the designer): J2 2*

### Layout directives
net class Undefined: (no net found under the mark)

### Notes on the sheet
- (in symbol AD8002AR, part A) A
- (in symbol AD8002AR, part B) B

### Library data of the parts
C1y C2y C3y C4y C35 C37 C39 C41 C43 C44 = Cap: Capacitor; Published: 8-Jun-2000; LatestRevisionDate: 17-Jul-2002; LatestRevisionNote: Re-released for DXP Platform.; PackageReference: RAD-0.3; Publisher: Altium Limited; PackageDescription: Radial Cap, Thru-Hole; 2 Leads; 0.3 in Pin Spacing
C36 C38 C40 C42 = Cap Pol3: Polarized Capacitor (Surface Mount); Published: 8-Jun-2000; LatestRevisionDate: 29-May-2009; LatestRevisionNote: IPC-7351 Footprint Added.; PackageReference: C0805; Publisher: Altium Limited; PackageDescription: Chip Capacitor
J2 = CL586-0556-5: as J1 on sheet 2SiPM_1; Published: 17-Jul-2002; DatasheetVersion: 13-Nov-2000; PackageVersion: 13-Nov-2000; PackageReference: FH12A-30S-0.5SH; Publisher: Altium Limited; ComponentLink1Description: Manufacturer Link; ComponentLink1URL: http://www.hiroseusa.com/; ComponentLink2Description: Datasheet; ComponentLink2URL: http://www.hirose.co.jp/cataloge_hp/e58605370.pdf
P4 = Header 2: Header, 2-Pin; LatestRevisionDate: 17-Jul-2002; LatestRevisionNote: Re-released for DXP Platform.; Publisher: Altium Limited
P5 = Header 2X2: Header, 2-Pin, Dual row; LatestRevisionDate: 17-Jul-2002; LatestRevisionNote: Re-released for DXP Platform.; Publisher: Altium Limited
R1g_1 R1x_1 R1y_1 R2g_1 R2x_1 R2y_1 R3g_1 R3x_1 R3y_1 R4g_1 R4x_1 R4y_1 R5g_1 R5x_1 R5y_1 R6g_1 R6x_1 R6y_1 R7g_1 R7x_1 R7y_1 R8g_1 R8x_1 R8y_1 R9g_1 R9x_1x R9y_1 R10g_1 R10x_1 R10y_1 R11g_1 R11x_1 R11y_1 R12g_1 R12x_1 R12y_1 R13g_1 R13x_1 R13y_1 R14g_1 R14x_1 R14y_1 R15g_1 R15x_1 R15y_1 R16g_1 R16x_1 R16y_1 R71-R92 RY1A RY1B RY1g RY2A RY2B RY2g RY3A RY3B RY3g RY4A RY4B RY4g = Res3: Resistor; Published: 8-Jun-2000; LatestRevisionDate: 29-May-2009; LatestRevisionNote: IPC-7351 Footprint Added.; PackageReference: J1-0603; Publisher: Altium Limited; PackageDescription: Chip Resistor
U9 U10 = AD8002AR: as U1 on sheet 2SiPM_1; Published: 8-Jun-2000; LatestRevisionDate: 13-Apr-2006; LatestRevisionNote: IPC-7351 Footprint Added.; DatasheetVersion: REV. C 1999; PackageVersion: revA; PackageReference: SO-8; Publisher: Altium Limited; PackageDescription: 8-Pin Small Outline Integrated Circuit 1.27 mm Pitch; Code_JEDEC: MS-012-AA; Code_IPC: SOIC127P600-8; ComponentLink1Description: Manufacturer Link; ComponentLink1URL: http://www.analog.com/en/prod/0,,759_786_AD8002%2C00.html; ComponentLink2Description: Datasheet; ComponentLink2URL: http://www.analog.com/UploadedFiles/Data_Sheets/147523773AD8002_d.pdf

## Sheet 2SiPM_4.SchDoc
size A4
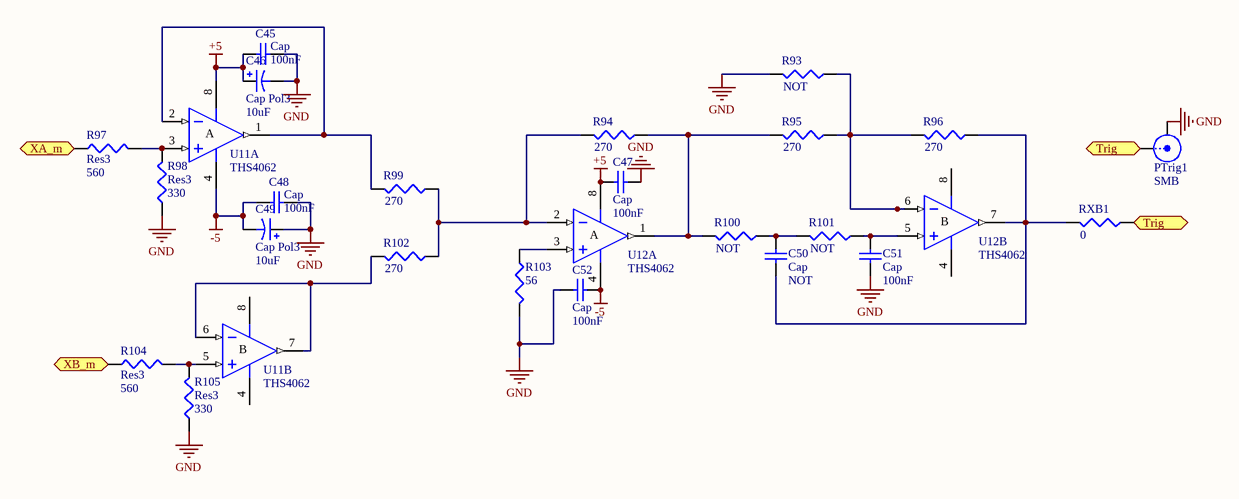
[diagram p3: 2SiPM_4.SchDoc]

### Parts
C45  Cap  value 100nF  [6-0805_N]
C46  Cap Pol3  value 10uF  [6-0805_N]
C47  Cap  value 100nF  [1608[0603]]
C48  Cap  value 100nF  [6-0805_N]
C49  Cap Pol3  value 10uF  [6-0805_N]
C50  Cap  value NOT  [1608[0603]]
C51  Cap  value 100nF  [1608[0603]]
C52  Cap  value 100nF  [1608[0603]]
PTrig1  SMB  [SMB_V-RJ45]
R93  value NOT  [J1-0603]  (hidden comment: Res3)
R94  value 270  [J1-0603]  (hidden comment: Res3)
R95  value 270  [J1-0603]  (hidden comment: Res3)
R96  value 270  [J1-0603]  (hidden comment: Res3)
R97  Res3  value 560  [J1-0603]
R98  Res3  value 330  [J1-0603]
R99  value 270  [J1-0603]  (hidden comment: Res3)
R100  value NOT  [J1-0603]  (hidden comment: Res3)
R101  value NOT  [J1-0603]  (hidden comment: Res3)
R102  value 270  [J1-0603]  (hidden comment: Res3)
R103  value 56  [J1-0603]  (hidden comment: Res3)
R104  Res3  value 560  [J1-0603]
R105  Res3  value 330  [J1-0603]
RXB1  value 0  [J1-0603]  (hidden comment: Res3)
U11  THS4062  [SO-8_M]  (parts A,B of 2)
U12  THS4062  [SO8_M]  (parts A,B of 2)

### Ports
Trig (out), XA_m (out), XB_m (out)

### Nets
+5: C45.2 C46.1 C47.1 U11.8(V+) U12.8(V+)
-5: C48.2 C49.2 C52.2 U11.4(V-) U12.4(V-)
GND: C45.1 C46.2 C47.2 C48.1 C49.1 C51.2 C52.1 PTrig1.2(Y) R93.2 R98.1 R103.2 R105.1
NetC22_2: R97.1 ; port XA_m
NetC30_2: R104.1 ; port XB_m
NetC50_1: C50.1 R100.1 R101.2
NetC50_2: C50.2 R96.1 RXB1.2 U12.7(OUT)
NetC51_1: C51.1 R101.1 U12.5(IN+)
NetPTrig1_1: PTrig1.1(X) RXB1.1 ; port Trig
NetR93_1: R93.1 R95.1 R96.2 U12.6(IN-)
NetR94_1: R94.1 R95.2 R100.2 U12.1(OUT)
NetR94_2: R94.2 R99.1 R102.1 U12.2(IN-)
NetR97_2: R97.2 R98.2 U11.3(IN+)
NetR99_2: R99.2 U11.1(OUT) U11.2(IN-)
NetR102_2: R102.2 U11.6(IN-) U11.7(OUT)
NetR103_1: R103.1 U12.3(IN+)
NetR104_2: R104.2 R105.2 U11.5(IN+)

### Notes on the sheet
- (in symbol AD8002AR, part A) A
- (in symbol AD8002AR, part B) B
- (in symbol AD8056ARM, part A) A
- (in symbol AD8056ARM, part B) B

### Library data of the parts
C45 C47 C48 C50-C52 = Cap: Capacitor; Published: 8-Jun-2000; LatestRevisionDate: 17-Jul-2002; LatestRevisionNote: Re-released for DXP Platform.; PackageReference: RAD-0.3; Publisher: Altium Limited; PackageDescription: Radial Cap, Thru-Hole; 2 Leads; 0.3 in Pin Spacing
C46 C49 = Cap Pol3: Polarized Capacitor (Surface Mount); Published: 8-Jun-2000; LatestRevisionDate: 29-May-2009; LatestRevisionNote: IPC-7351 Footprint Added.; PackageReference: C0805; Publisher: Altium Limited; PackageDescription: Chip Capacitor
PTrig1 = SMB: SMB Straight Connector; LatestRevisionDate: 17-Jul-2002; LatestRevisionNote: Re-released for DXP Platform.; Publisher: Altium Limited
R93-R105 RXB1 = Res3: Resistor; Published: 8-Jun-2000; LatestRevisionDate: 29-May-2009; LatestRevisionNote: IPC-7351 Footprint Added.; PackageReference: J1-0603; Publisher: Altium Limited; PackageDescription: Chip Resistor
U11 = AD8002AR: as U1 on sheet 2SiPM_1; Published: 8-Jun-2000; LatestRevisionDate: 13-Apr-2006; LatestRevisionNote: IPC-7351 Footprint Added.; DatasheetVersion: REV. C 1999; PackageVersion: revA; PackageReference: SO-8; Publisher: Altium Limited; PackageDescription: 8-Pin Small Outline Integrated Circuit 1.27 mm Pitch; Code_JEDEC: MS-012-AA; Code_IPC: SOIC127P600-8; ComponentLink1Description: Manufacturer Link; ComponentLink1URL: http://www.analog.com/en/prod/0,,759_786_AD8002%2C00.html; ComponentLink2Description: Datasheet; ComponentLink2URL: http://www.analog.com/UploadedFiles/Data_Sheets/147523773AD8002_d.pdf
U12 = AD8056ARM: as U5 on sheet 2SiPM_2; Published: 8-Jun-2000; LatestRevisionDate: 04-Mar-2005; LatestRevisionNote: Stylized 3D Model Added, PCB footprint pad width decreased.; DatasheetVersion: REV. 0 1997; PackageVersion: 2004; PackageReference: RM-8; Publisher: Altium Limited; PackageDescription: Shrink Small Outline, MSOP; 8 Leads; Body Width 3 mm; Pitch 0.65 mm; Code_JEDEC: MO-187-AA; ComponentLink1Description: Manufacturer Link; ComponentLink1URL: http://www.analog.com/en/prod/0,,759_786_AD8055%2C00.html; ComponentLink2Description: Datasheet; ComponentLink2URL: http://www.analog.com/UploadedFiles/Data_Sheets/40402558757264AD8055_6_i.pdf

## Nets that join several sheets
+5: 2SiPM_1 (12 pins), 2SiPM_2 (9 pins), 2SiPM_3 (6 pins), 2SiPM_4 (5 pins)
+70V: 2SiPM_1 (J1.1), 2SiPM_2 (C34.2 R69.1)
-5: 2SiPM_1 (12 pins), 2SiPM_2 (9 pins), 2SiPM_3 (6 pins), 2SiPM_4 (5 pins)
GND: 2SiPM_1 (59 pins), 2SiPM_2 (35 pins), 2SiPM_3 (49 pins), 2SiPM_4 (12 pins)
NetC1x_1: 2SiPM_1 (R2.1 U1.1), 2SiPM_2 (C1x.1)
NetC2x_1: 2SiPM_1 (R5.1 U1.7), 2SiPM_2 (C2x.1)
NetC3x_1: 2SiPM_1 (R13.1 U2.1), 2SiPM_2 (C3x.1)
NetC4x_1: 2SiPM_1 (R15.1 U2.7), 2SiPM_2 (C4x.1)
NetC5y_1: 2SiPM_1 (R25.1 U4.1), 2SiPM_2 (C5y.1)
NetC6y_1: 2SiPM_1 (R29.1 U4.7), 2SiPM_2 (C6y.1)
NetC7y_1: 2SiPM_1 (R3.1 U3.1), 2SiPM_2 (C7y.1)
NetC8y_1: 2SiPM_1 (R23.1 U3.7), 2SiPM_2 (C8y.1)
NetC22_2: 2SiPM_2 (C22.2 R47.1 RXA.2 U6.7), 2SiPM_4 (R97.1)
NetC30_2: 2SiPM_2 (C30.2 R61.1 RXB.2 U8.7), 2SiPM_4 (R104.1)
NetJ1_17: 2SiPM_1 (J1.17), 2SiPM_2 (P1.2)
NetJ1_18: 2SiPM_1 (J1.18), 2SiPM_2 (P1.3)
NetJ1_19: 2SiPM_1 (J1.19), 2SiPM_2 (P1.1)
NetR1x_1: 2SiPM_1 (6 pins), 2SiPM_3 (R13x_1.1 R14x_1.1 R15x_1.1 R16x_1.1)
NetR1x_1_1: 2SiPM_1 (6 pins), 2SiPM_3 (R1x_1.1 R2x_1.1 R3x_1.1 R4x_1.1)
NetR5x_1: 2SiPM_1 (6 pins), 2SiPM_3 (R9x_1x.1 R10x_1.1 R11x_1.1 R12x_1.1)
NetR5x_1_1: 2SiPM_1 (6 pins), 2SiPM_3 (R5x_1.1 R6x_1.1 R7x_1.1 R8x_1.1)
NetR42_2: 2SiPM_2 (6 pins), 2SiPM_3 (RY1A.1 RY2A.1 RY3A.1 RY4A.1)
NetR56_2: 2SiPM_2 (6 pins), 2SiPM_3 (RY1B.1 RY2B.1 RY3B.1 RY4B.1)